# Altium project 8051ExpBoard.PrjPcb
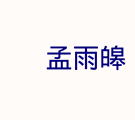
[diagram p0: 51ExpBoardTotal.SchDoc]
4 sheets, 206 parts. Net scope: flat (ports and power ports of the same name join across sheets).
Sheets:
  51ExpBoardTotal.SchDoc
  ADC_DAC.SchDoc
  CPU.SchDoc
  KeyLED.SchDoc

## Sheet 51ExpBoardTotal.SchDoc
size A4

### Notes on the sheet
- 孟雨皞

## Sheet ADC_DAC.SchDoc
size A3
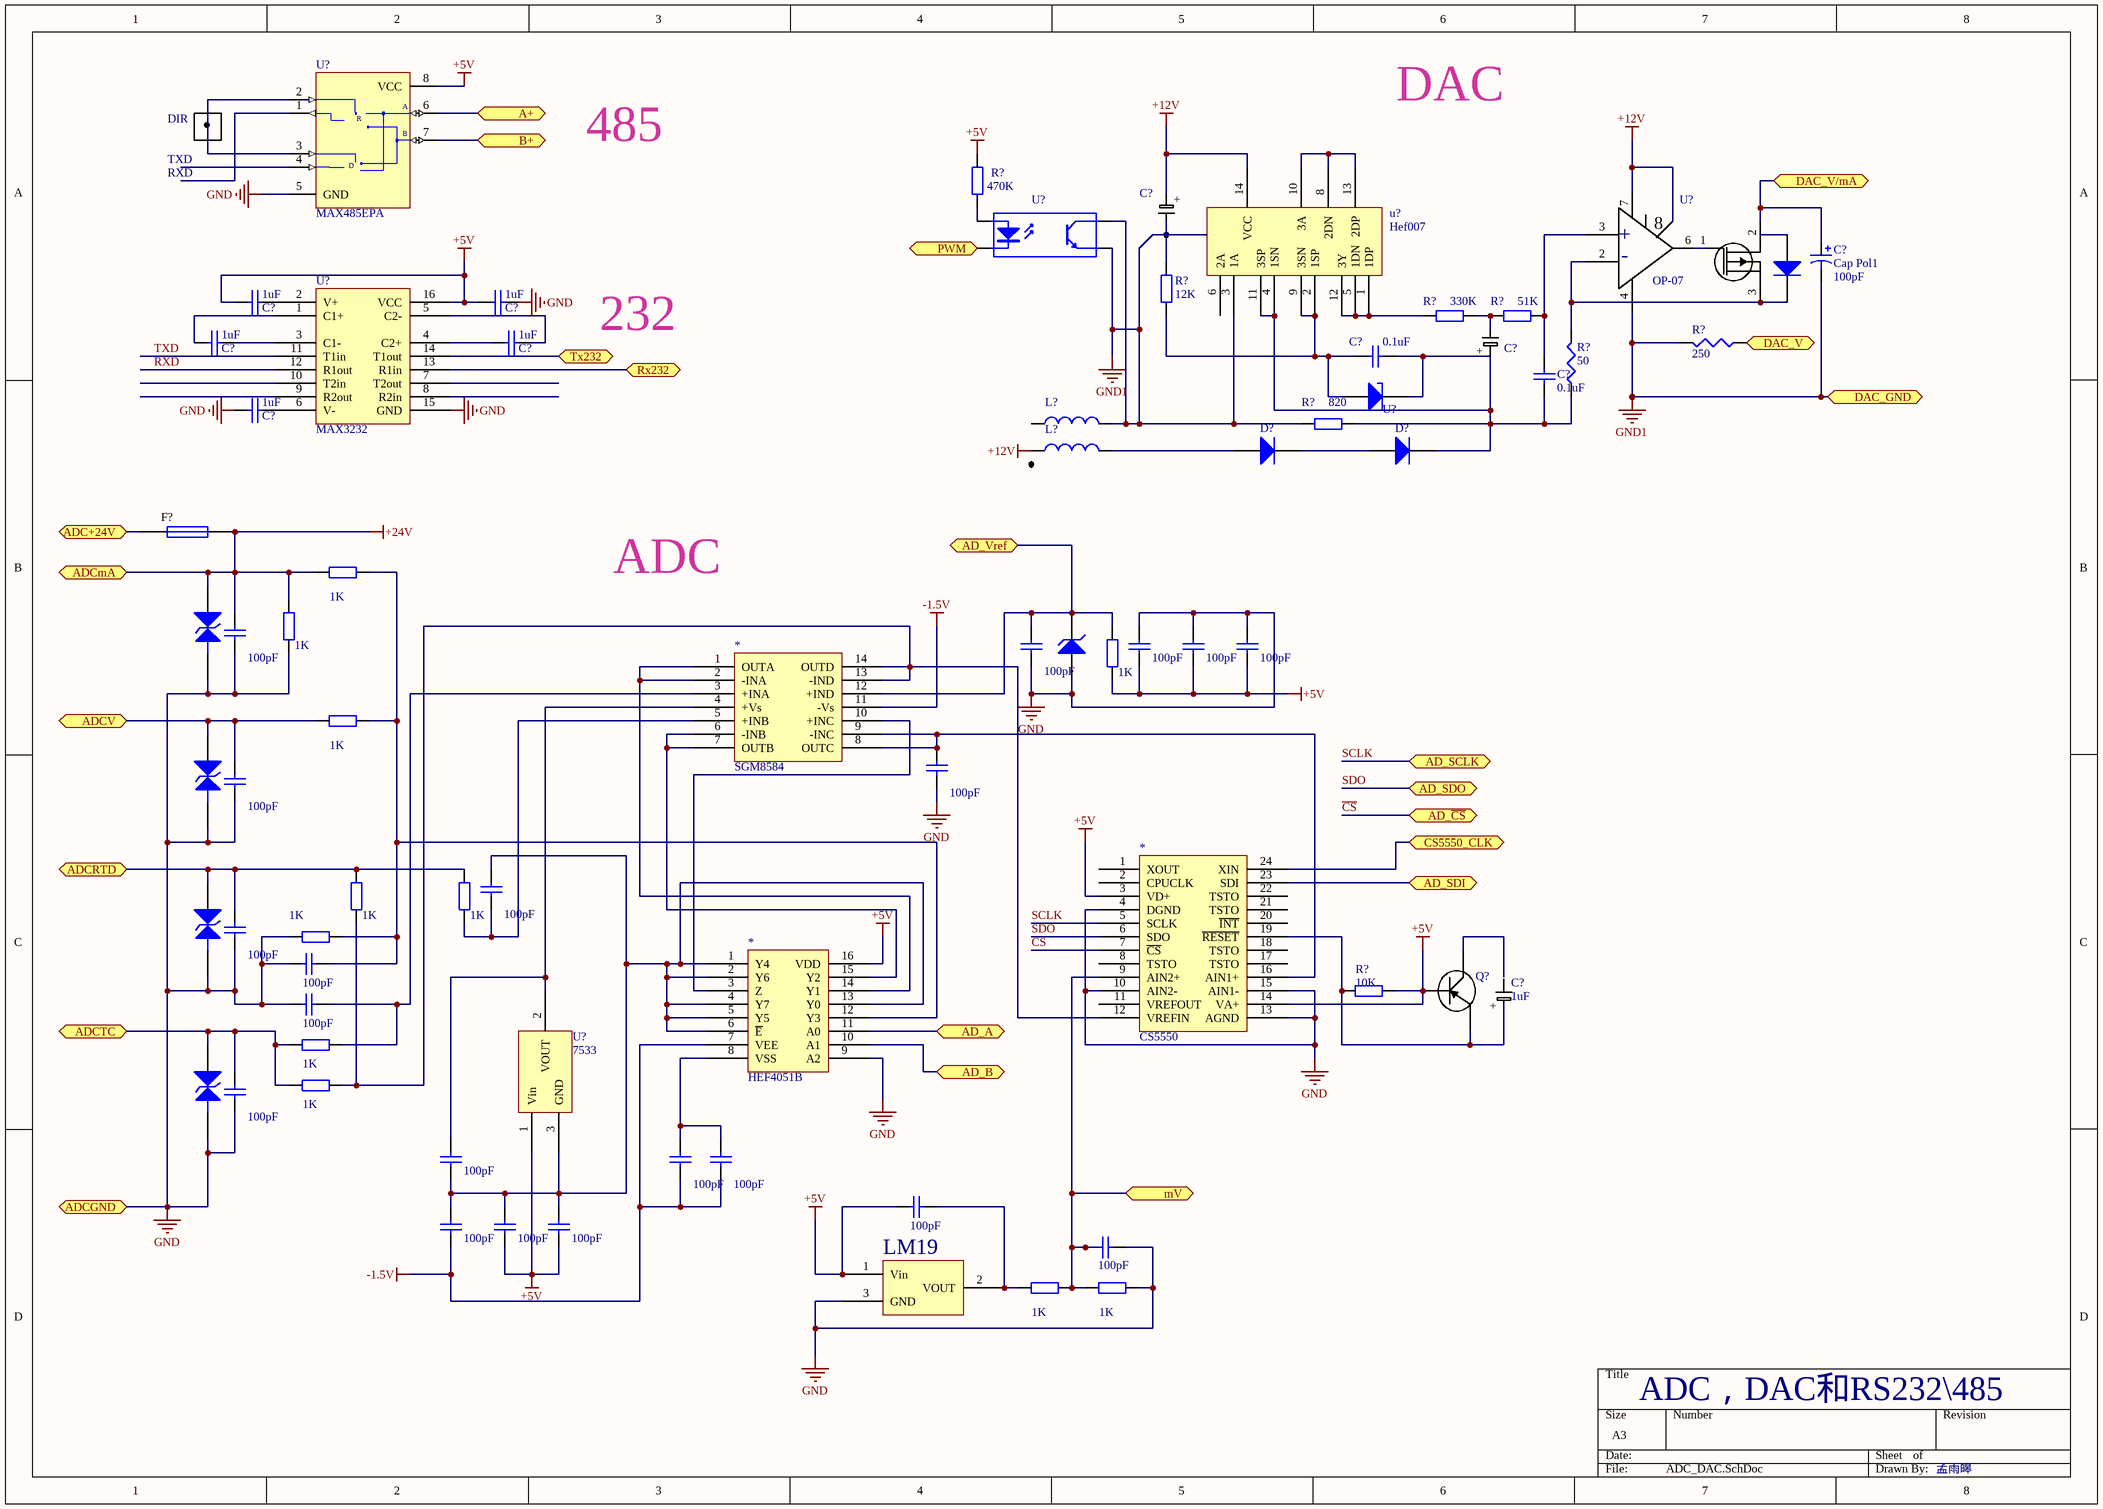
[diagram p1: ADC_DAC.SchDoc]

### Parts
(Parts that share a designator on the sheet are numbered #1, #2 ... from top to bottom, then left to right.)
*#1  ZENER3  (value not drawn)
*#2  SGM8584
*#3  CS5550
*#4  HEF4051B
*?#1  Component_1  (value not drawn)
*?#2  Component_1  (value not drawn)
*?#3  ZENER3  (value not drawn)
*?#4  ZENER3  (value not drawn)
*?#5  ZENER3  (value not drawn)
?#1  DIR
?#2  Component_1  (value not drawn)
?#3  Diode 1N4007  [D#1]  (value not drawn)
C?#1  Component_1  (value not drawn)
C?#2  Cap Pol1  value 100pF  [RB7.6-15]
C?#3  1uF  [0603C]
C?#4  1uF  [0603C]
C?#5  Component_1  (value not drawn)
C?#6  value 0.1uF  [RAD-0.3]  (hidden comment: Cap)
C?#7  1uF  [0603C]
C?#8  1uF  [0603C]
C?#9  value 0.1uF  [RAD-0.3]  (hidden comment: Cap)
C?#10  1uF  [0603C]
C?#11  value 100pF  [RAD-0.3]  (hidden comment: Cap)
C?#12  value 100pF  [RAD-0.3]  (hidden comment: Cap)
C?#13  value 100pF  [RAD-0.3]  (hidden comment: Cap)
C?#14  value 100pF  [RAD-0.3]  (hidden comment: Cap)
C?#15  value 100pF  [RAD-0.3]  (hidden comment: Cap)
C?#16  value 100pF  [RAD-0.3]  (hidden comment: Cap)
C?#17  value 100pF  [RAD-0.3]  (hidden comment: Cap)
C?#18  value 100pF  [RAD-0.3]  (hidden comment: Cap)
C?#19  value 100pF  [RAD-0.3]  (hidden comment: Cap)
C?#20  value 100pF  [RAD-0.3]  (hidden comment: Cap)
C?#21  1uF
C?#22  value 100pF  [RAD-0.3]  (hidden comment: Cap)
C?#23  value 100pF  [RAD-0.3]  (hidden comment: Cap)
C?#24  value 100pF  [RAD-0.3]  (hidden comment: Cap)
C?#25  value 100pF  [RAD-0.3]  (hidden comment: Cap)
C?#26  value 100pF  [RAD-0.3]  (hidden comment: Cap)
C?#27  value 100pF  [RAD-0.3]  (hidden comment: Cap)
C?#28  value 100pF  [RAD-0.3]  (hidden comment: Cap)
C?#29  value 100pF  [RAD-0.3]  (hidden comment: Cap)
C?#30  value 100pF  [RAD-0.3]  (hidden comment: Cap)
C?#31  value 100pF  [RAD-0.3]  (hidden comment: Cap)
D?#1  Diode 1N4007  [D#1]  (value not drawn)
D?#2  Diode 1N4007  [D#1]  (value not drawn)
D?#3  D Zener  [DIODE-0.7]  (value not drawn)
F?  12  [PIN-W2/E2.8]  (value not drawn)
L?#1  IHLP2525CZER6R8M01/6.8UH  [IHLP2525CZER6R8M01/6.8UH]  (value not drawn)
L?#2  IHLP2525CZER6R8M01/6.8UH  [IHLP2525CZER6R8M01/6.8UH]  (value not drawn)
Q#?  IRF3205  [irf3205]  (value not drawn)
Q?#1  8550  (value not drawn)
Q?#2  LM19
R?#1  value 470K  [AXIAL-0.4]  (hidden comment: Res2)
R?#2  value 12K  [AXIAL-0.4]  (hidden comment: Res2)
R?#3  value 330K  [AXIAL-0.4]  (hidden comment: Res2)
R?#4  value 51K  [AXIAL-0.4]  (hidden comment: Res2)
R?#5  value 250  [J1-0603]  (hidden comment: Res3)
R?#6  value 50  [J1-0603]  (hidden comment: Res3)
R?#7  value 820  [AXIAL-0.4]  (hidden comment: Res2)
R?#8  value 1K  [AXIAL-0.4]  (hidden comment: Res2)
R?#9  value 1K  [AXIAL-0.4]  (hidden comment: Res2)
R?#10  value 1K  [AXIAL-0.4]  (hidden comment: Res2)
R?#11  value 1K  [AXIAL-0.4]  (hidden comment: Res2)
R?#12  value 1K  [AXIAL-0.4]  (hidden comment: Res2)
R?#13  value 1K  [AXIAL-0.4]  (hidden comment: Res2)
R?#14  value 1K  [AXIAL-0.4]  (hidden comment: Res2)
R?#15  value 10K  [AXIAL-0.4]  (hidden comment: Res2)
R?#16  value 1K  [AXIAL-0.4]  (hidden comment: Res2)
R?#17  value 1K  [AXIAL-0.4]  (hidden comment: Res2)
R?#18  value 1K  [AXIAL-0.4]  (hidden comment: Res2)
R?#19  value 1K  [AXIAL-0.4]  (hidden comment: Res2)
U?#1  MAX485EPA  [PA8]
U?#2  Optoisolator1  [DIP-4]  (value not drawn)
U?#3  OP-07
u?#4  Hef007
U?#5  MAX3232  [max3232]
U?#6  SBR3U40P1  [SBR3U40P1]  (value not drawn)
U?#7  7533

### Ports
A+, AD_A, AD_B, AD_SCLK, AD_SDI, AD_SDO, AD_Vref, AD_~{CS}, ADC+24V, ADCGND, ADCmA, ADCRTD, ADCTC, ADCV, B+, CS5550_CLK, DAC_GND, DAC_V, DAC_V/mA, mV, PWM, Rx232, Tx232

### Nets
+5V: *#3.3(VD+) *#3.14(VA+) *#4.16(VDD) C?#3.1 C?#4.1 C?#13.1 C?#14.1 C?#15.1 C?#27.1 C?#29.1 C?#30.1 Q?#1.7 Q?#2.1(Vin) R?#1.2 R?#10.1 R?#15.2 U?#1.8(VCC) U?#5.16(VCC) U?#7.1(Vin)  [project net D7]
+12V: L?#2.1 U?#3.7 u?#4.14(VCC)
+24V: *#1.2(K) C?#11.2 F?.2 R?#8.1 R?#9.2 ; port ADCmA
-1.5V: *#2.11(-Vs) *#4.7(VEE) C?#25.1 C?#26.1 C?#28.1
GND: *#1.1(A) *#3.4(DGND) *#3.10(AIN2-) *#3.13(AGND) *#3.15(AIN1-) *#4.9(A2) *?#3.1(A) *?#4.1(A) *?#5.1(A) C?#4.2 C?#10.1 C?#11.1 C?#12.1 C?#13.2 C?#14.2 C?#15.2 C?#16.1 C?#17.1 C?#19.1 C?#20.1 C?#22.1 C?#23.1 C?#31.1 D?#3.1(A) Q?#2.3(GND) R?#9.1 R?#14.1 R?#19.2 U?#1.5(GND) U?#5.15(GND) ; port ADCGND
GND1: C?#2.2 L?#1.2 R?#5.2 R?#7.1 U?#2.3(E) U?#2.4(C) U?#3.4 u?#4.3(1A) ; port DAC_GND
~{CS}: *#3.7(~{CS}) ; port AD_~{CS}
RXD: U?#5.12(R1out)
SCLK: *#3.5(SCLK) ; port AD_SCLK
SDO: *#3.6(SDO) ; port AD_SDO
TXD: U?#5.11(T1in)
Net*#2_1: *#2.1(OUTA) *#2.2(-INA) *#4.14(Y1)
Net*#2_3: *#2.3(+INA) C?#22.2 R?#16.2
Net*#2_4: *#2.4(+Vs) C?#24.2 U?#7.2(VOUT)
Net*#2_5: *#2.5(+INB) C?#18.1 R?#13.1
Net*#2_6: *#2.6(-INB) *#2.7(OUTB) *#4.15(Y2)
Net*#2_8: *#2.8(OUTC) *#2.9(-INC) *#3.16(AIN1+) C?#16.2
Net*#2_10: *#2.10(+INC) *#4.3(Z)
Net*#2_12: *#2.12(+IND) C?#12.2 D?#3.2(K) R?#10.2 ; port AD_Vref
Net*#2_13: *#2.13(-IND) *#2.14(OUTD) *#3.12(VREFIN) R?#12.2 R?#17.2
Net*#3_9: *#3.9(AIN2+) C?#31.2 R?#18.2 R?#19.1 ; port mV
Net*#3_19: *#3.19(~{RESET}) Q?#1.8 R?#15.1
Net*#3_23: *#3.23(SDI) ; port AD_SDI
Net*#3_24: *#3.24(XIN) ; port CS5550_CLK
Net*#4_1: *#4.1(Y4) *#4.2(Y6) *#4.4(Y7) *#4.5(Y5) *#4.6(~{E}) *#4.13(Y0) C?#18.2 C?#24.1 C?#28.2 C?#29.2 C?#30.2 U?#7.3(GND)
Net*#4_8: *#4.8(VSS) C?#25.2 C?#26.2
Net*#4_10: *#4.10(A1) ; port AD_B
Net*#4_11: *#4.11(A0) ; port AD_A
Net*#4_12: *#4.12(Y3) C?#20.2 R?#8.2 R?#11.2 R?#14.2
Net*?#3_2: *?#3.2(K) C?#17.2 R?#11.1 ; port ADCV
Net*?#4_2: *?#4.2(K) C?#19.2 R?#12.1 R?#13.2 ; port ADCRTD
Net*?#5_2: *?#5.2(K) C?#23.2 R?#16.1 R?#17.1 ; port ADCTC
Net?#3_2: ?#3.2(K) Q#?.3(S) R?#6.2 U?#3.2
NetC?#2_1: C?#2.1 Q#?.2(D) ; port DAC_V/mA
NetC?#3_2: C?#3.2 U?#5.2(V+)
NetC?#6_1: C?#6.1 R?#2.1 u?#4.2(1SP) u?#4.9(3SN) U?#6.1(A)
NetC?#6_2: C?#6.2 C?#9.1 D?#2.2(K) R?#6.1 R?#7.2 u?#4.4(1SN) u?#4.11(3SP) U?#6.2(K)
NetC?#7_1: C?#7.1 U?#5.1(C1+)
NetC?#7_2: C?#7.2 U?#5.3(C1-)
NetC?#8_1: C?#8.1 U?#5.4(C2+)
NetC?#8_2: C?#8.2 U?#5.5(C2-)
NetC?#9_2: C?#9.2 R?#4.2 U?#3.3
NetC?#10_2: C?#10.2 U?#5.6(V-)
NetC?#27_2: C?#27.2 Q?#2.2(VOUT) R?#18.1
NetD?#1_1: D?#1.1(A) L?#2.2
NetD?#1_2: D?#1.2(K) D?#2.1(A)
NetF?_1: F?.1 ; port ADC+24V
NetQ#?_1: Q#?.1 U?#3.6
NetR?#1_1: R?#1.1 U?#2.1(A)
NetR?#3_1: R?#3.1 u?#4.1(1DP) u?#4.5(1DN) u?#4.12(3Y)
NetR?#3_2: R?#3.2 R?#4.1
NetR?#5_1: R?#5.1 ; port DAC_V
NetU?#1_2: U?#1.2(~{RE}) U?#1.3(DE)
NetU?#1_6: U?#1.6(A) ; port A+
NetU?#1_7: U?#1.7(B) ; port B+
NetU?#2_2: U?#2.2(K) ; port PWM
Netu?#4_8: u?#4.8(2DN) u?#4.10(3A) u?#4.13(2DP)
NetU?#5_13: U?#5.13(R1in) ; port Rx232
NetU?#5_14: U?#5.14(T1out) ; port Tx232

Not connected (* = marked no-connect by the designer): *#3 1(XOUT) 2(CPUCLK) 8(TSTO) 11(VREFOUT) 17(TSTO) 18(TSTO) 20(~{INT}) 21(TSTO) 22(TSTO); ?#3 1(A); L?#1 1; Q?#1 9; R?#2 2; U?#1 1(RO) 4(DI); U?#3 17; u?#4 6(2A); U?#5 7(T2out) 8(R2in) 9(R2out) 10(T2in)

### Notes on the sheet
- DAC
- (near ?#1) TXD
- RXD
- 485
- 232
- ADC
- ADC，DAC和RS232\485
- 孟雨皞
- (in symbol Component_1) +
- (in symbol MAX485EPA) R; D
- (in symbol 方框) .
- (in symbol 运放) 8; +; -

### Library data of the parts
?#1 = 方框
?#3 D?#1 D?#2 = Diode 1N4007: 1 Amp General Purpose Rectifier; Published: 8-Jun-2000; LatestRevisionDate: 17-Jul-2002; LatestRevisionNote: Re-released for DXP Platform.; DatasheetDocument: 1998; PackageDocument: Aug-1999; PackageReference: DO-41; Publisher: Altium Limited; Code_JEDEC: DO-204-AL; ComponentLink1Description: Manufacturer Link; ComponentLink1URL: http://www.fairchildsemi.com/; ComponentLink2Description: Datasheet; ComponentLink2URL: http://www.fairchildsemi.com/ds/1N%2F1N4001.pdf
C?#2 = Cap Pol1: Polarized Capacitor (Radial); Published: 8-Jun-2000; LatestRevisionDate: 17-Jul-2002; LatestRevisionNote: Re-released for DXP Platform.; PackageReference: RB7.6-15; Publisher: Altium Limited; PackageDescription: Polarized Capacitor (Radial); 2 Leads
C?#3 C?#4 C?#7 C?#8 C?#10 = CAP: Capacitor
C?#6 C?#9 C?#11-C?#20 C?#22-C?#31 = Cap: Capacitor; Published: 8-Jun-2000; LatestRevisionDate: 17-Jul-2002; LatestRevisionNote: Re-released for DXP Platform.; PackageReference: RAD-0.3; Publisher: Altium Limited; PackageDescription: Radial Cap, Thru-Hole; 2 Leads; 0.3 in Pin Spacing
C?#21 Q?#2 u?#4 U?#7 = Component_1
D?#3 = D Zener: Zener Diode; Published: 8-Jun-2000; LatestRevisionDate: 17-Jul-2002; LatestRevisionNote: Re-released for DXP Platform.; PackageReference: DIODE-0.7; Publisher: Altium Limited; PackageDescription: Diode, Thru-Hole; 2 Leads; 0.7 in Pin Spacing
F? = Fuse 1: Fuse; Published: 8-Jun-2000; LatestRevisionDate: 17-Jul-2002; LatestRevisionNote: Re-released for DXP Platform.; PackageReference: PIN-W2/E2.8; Publisher: Altium Limited; PackageDescription: Thru-Hole; 2 Leads
L?#1 L?#2 = Inductor: Code_IEC: 1005; Value: 4.7uh; Published: 8-Jun-2000; LatestRevisionDate: 17-Jul-2002; LatestRevisionNote: Re-released for DXP Platform.; PackageReference: 0402-A; Publisher: Altium Limited; Code_JEITA: 0402
Q#? = PMOS1: N-Channel Power MOSFET; Note: Pin 2 is electrically connected to pin 4.; Published: 8-Jun-2000; LatestRevisionDate: 17-Jul-2002; LatestRevisionNote: Re-released for DXP Platform.; DatasheetVersion: PD-9.814; PackageReference: TO-220AB; Publisher: Altium Limited; Code_JEDEC: TO-220-AB; ComponentLink1Description: Manufacturer Link; ComponentLink1URL: http://www.irf.com/
R?#1-R?#4 R?#7-R?#19 = Res2: Resistor; Published: 8-Jun-2000; LatestRevisionDate: 17-Jul-2002; LatestRevisionNote: Re-released for DXP Platform.; PackageReference: AXIAL-0.4; Publisher: Altium Limited
  R?#8-R?#14 R?#16-R?#19: PackageDescription: Axial Device, Thru-Hole; 2 Leads; 0.4 in Pin Spacing
R?#5 R?#6 = Res3: Resistor; Published: 8-Jun-2000; LatestRevisionDate: 04-Mar-2005; LatestRevisionNote: PCB Footprint replaced.; PackageReference: J1-0603; Publisher: Altium Limited
U?#1 = MAX485EPA: Low-Power, Slew-Rate-Limited RS-485/RS-422 Transceiver; Published: 16-Jan-2001; LatestRevisionDate: 29-May-2009; LatestRevisionNote: Component Body Added.; DatasheetVersion: Feb-1996; PackageVersion: RevB, 21-0043; PackageReference: PA8; Publisher: Altium Limited; PackageDescription: DIP, 8-Pin, Row Spacing 7.62 mm, Pitch 2.54 mm; Code_JEDEC: MS-001-AB; ComponentLink1Description: Manufacturer Link; ComponentLink1URL: http://www.maxim-ic.com/; ComponentLink2Description: Datasheet; ComponentLink2URL: http://pdfserv.maxim-ic.com/en/ds/MAX1487-MAX491.pdf
U?#2 = Optoisolator1: 4-Pin Phototransistor Optocoupler; Published: 24-Mar-1999; LatestRevisionDate: 04-Mar-2005; LatestRevisionNote: Sch pins 3 & 4 Swapped.; DatasheetVersion: Nov-2003; PackageReference: DIP-4; Publisher: Altium Limited
U?#3 = 运放
U?#6 = 稳压管: Zener Diode; Published: 8-Jun-2000; LatestRevisionDate: 17-Jul-2002; LatestRevisionNote: Re-released for DXP Platform.; PackageReference: DIODE-0.7; Publisher: Altium Limited

## Sheet CPU.SchDoc
size A3
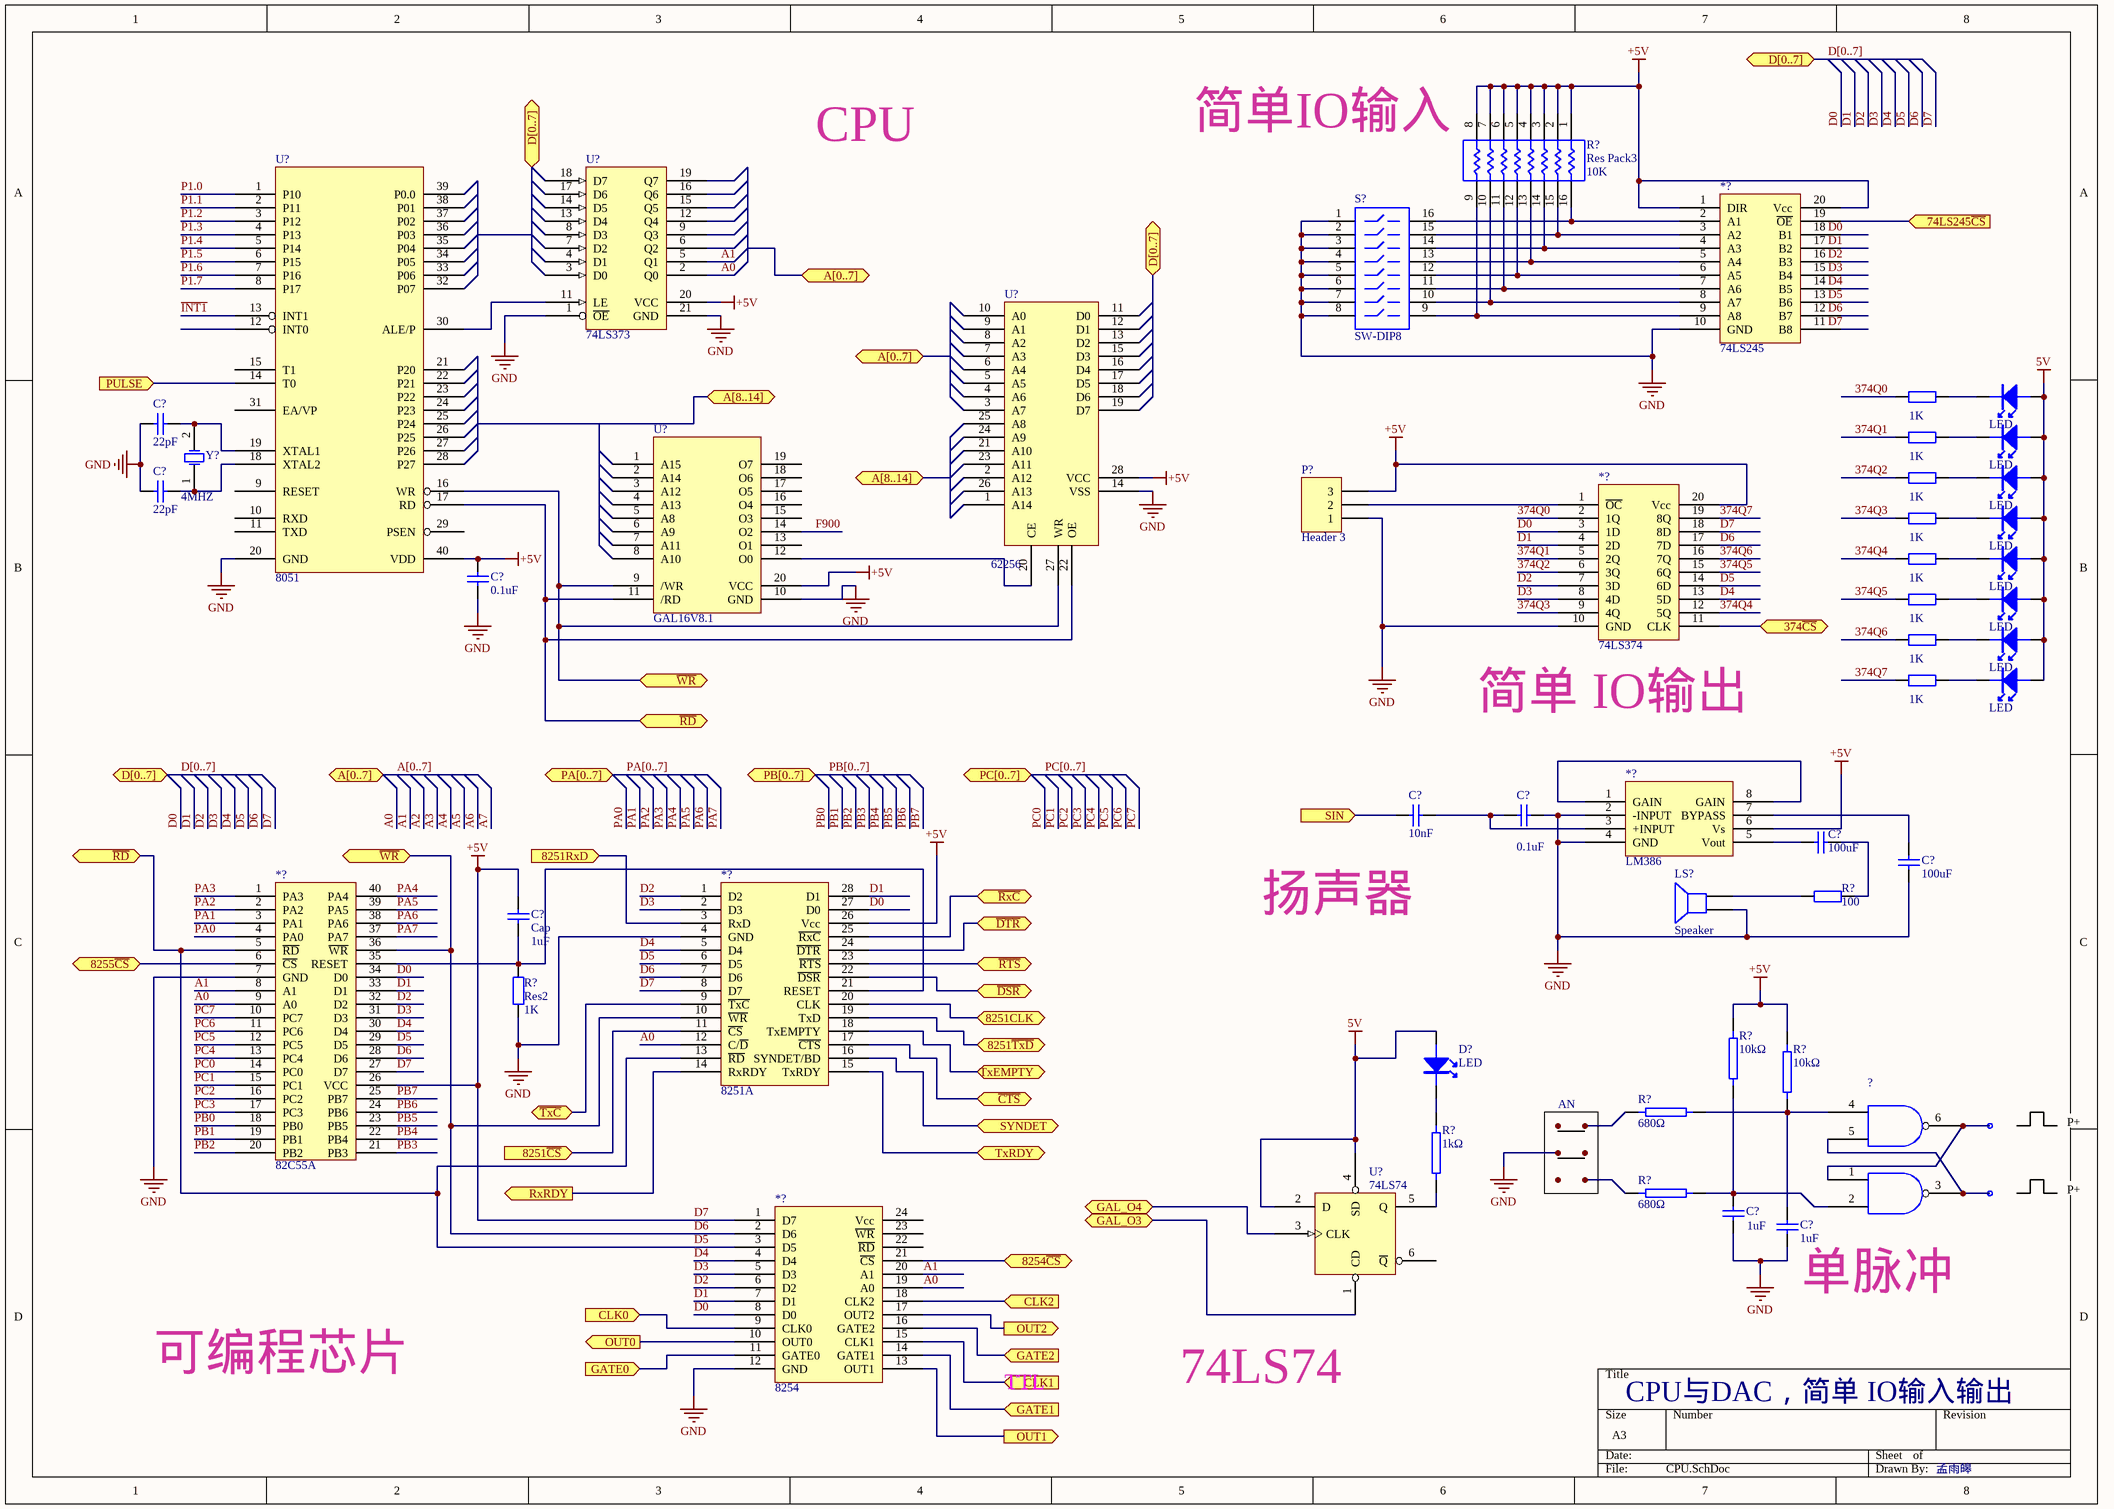
[diagram p2: CPU.SchDoc]

### Parts
(Parts that share a designator on the sheet are numbered #1, #2 ... from top to bottom, then left to right.)
*?#6  74LS245
*?#7  74LS374
*?#8  LM386
*?#9  8251A
*?#10  82C55A
*?#11  8254
?#4  74LS00  (value not drawn)
C?#32  value 22pF  [RAD-0.3]
C?#33  value 22pF  [RAD-0.3]
C?#34  value 0.1uF  [RAD-0.3]
C?#35  value 0.1uF  [RAD-0.3]
C?#36  value 10nF  [RAD-0.3]
C?#37  value 100uF  [RAD-0.3]
C?#38  value 100uF  [RAD-0.3]
C?#39  Cap  value 1uF  [RAD-0.3]
C?#40  value 1uF  [RAD-0.3]
C?#41  value 1uF  [RAD-0.3]
D?#4  LED
D?#5  LED
D?#6  LED
D?#7  LED
D?#8  LED
D?#9  LED
D?#10  LED
D?#11  LED
D?#12  LED
LS?  Speaker  [PIN2]
P?  Header 3  [HDR1X3]
R?#20  Res Pack3  value 10K  [SO-16_N]
R?#21  value 1K  [AXIAL-0.4]  (hidden comment: Res2)
R?#22  value 1K  [AXIAL-0.4]  (hidden comment: Res2)
R?#23  value 1K  [AXIAL-0.4]  (hidden comment: Res2)
R?#24  value 1K  [AXIAL-0.4]  (hidden comment: Res2)
R?#25  value 1K  [AXIAL-0.4]  (hidden comment: Res2)
R?#26  value 1K  [AXIAL-0.4]  (hidden comment: Res2)
R?#27  value 1K  [AXIAL-0.4]  (hidden comment: Res2)
R?#28  value 1K  [AXIAL-0.4]  (hidden comment: Res2)
R?#29  value 100  [AXIAL-0.4]
R?#30  Res2  value 1K  [AXIAL-0.4]
R?#31  10kΩ
R?#32  10kΩ
R?#33  680Ω
R?#34  1kΩ
R?#35  680Ω
S?#1  SW-DIP8  [DIP-16-KEY]
U?#8  74LS373
U?#9  62256
U?#10  8051
U?#11  GAL16V8.1
U?#12  74LS74
Y?  4MHZ  [crystals]

### Ports
74LS245~{CS} (in), 374~{CS}, 8251CLK, 8251RxD (in), 8251~{CS} (in), 8251~{TxD}, 8254~{CS}, 8255~{CS}, A[0..7], A[0..7] (bidir), A[8..14], CLK0 (in), CLK1 (in), CLK2 (in), D[0..7], D[0..7] (bidir), GAL_O3, GAL_O4, GATE0 (in), GATE1 (in), GATE2 (in), OUT0 (out), OUT1 (out), OUT2 (out), PA[0..7] (bidir), PB[0..7] (bidir), PC[0..7] (bidir), PULSE (in), RxRDY (out), SIN (in), SYNDET, TxEMPTY (bidir), TxRDY, ~{CTS}, ~{DSR}, ~{DTR} (bidir), ~{RD}, ~{RD} (bidir), ~{RTS} (bidir), ~{RxC}, ~{TxC}, ~{WR}

### Nets
5V: D?#4.1 D?#5.1 D?#6.1 D?#7.1 D?#8.1 D?#9.1 D?#10.1 D?#11.1 D?#12.1 U?#12.2(D) U?#12.4(SD)
D7: *?#6.1(DIR) *?#6.20(Vcc) *?#7.18(8D) *?#7.20(Vcc) *?#8.6(Vs) *?#9.8(D7) *?#9.26(Vcc) *?#10.26(VCC) *?#10.27(D7) *?#11.1(D7) C?#34.1 C?#39.1 P?.3 R?#20.1 R?#20.2 R?#20.3 R?#20.4 R?#20.5 R?#20.6 R?#20.7 R?#20.8 R?#31.2 R?#32.2 U?#8.20(VCC) U?#9.28(VCC) U?#10.40(VDD) U?#11.20(VCC)  [also labelled +5V]
GND: *?#6.10(GND) *?#7.10(GND) *?#8.2(-INPUT) *?#8.4(GND) *?#9.4(GND) *?#10.7(GND) *?#11.12(GND) C?#32.2 C?#33.2 C?#34.2 C?#35.2 C?#38.1 C?#40.1 C?#41.1 LS?.1 P?.1 R?#30.2 S?#1.1 S?#1.2 S?#1.3 S?#1.4 S?#1.5 S?#1.6 S?#1.7 S?#1.8 U?#8.1(~{OE}) U?#8.21(GND) U?#9.14(VSS) U?#10.20(GND) U?#11.10(GND)
374Q0: *?#7.2(1Q) R?#21.1
374Q1: *?#7.5(2Q) R?#22.1
374Q2: *?#7.6(3Q) R?#23.1
374Q3: *?#7.9(4Q) R?#24.1
374Q4: *?#7.12(5Q) R?#25.1
374Q5: *?#7.15(6Q) R?#26.1
374Q6: *?#7.16(7Q) R?#27.1
374Q7: *?#7.19(8Q) R?#28.1
A0: *?#9.12(C/~{D}) *?#10.9(A0) *?#11.19(A0) U?#8.2(Q0)
A1: *?#10.8(A1) *?#11.20(A1) U?#8.5(Q1)
D0: *?#7.3(1D) *?#9.27(D0) *?#10.34(D0) *?#11.8(D0)
D1: *?#7.4(2D) *?#9.28(D1) *?#10.33(D1) *?#11.7(D1)
D2: *?#7.7(3D) *?#9.1(D2) *?#10.32(D2) *?#11.6(D2)
D3: *?#7.8(4D) *?#9.2(D3) *?#10.31(D3) *?#11.5(D3)
D4: *?#7.13(5D) *?#9.5(D4) *?#10.30(D4) *?#11.4(D4)
D5: *?#7.14(6D) *?#9.6(D5) *?#9.13(~{RD}) *?#10.5(~{RD}) *?#10.29(D5) *?#11.3(D5) U?#9.22(OE) U?#10.17(RD) U?#11.11(/RD) ; port ~{RD}
D6: *?#7.17(7D) *?#9.7(D6) *?#9.10(~{WR}) *?#10.28(D6) *?#10.36(~{WR}) *?#11.2(D6) U?#9.27(WR) U?#10.16(WR) U?#11.9(/WR) ; port ~{WR}
F900: U?#11.14(O2)
~{INT1}: U?#10.13(INT1)
P1.0: U?#10.1(P10)
P1.1: U?#10.2(P11)
P1.2: U?#10.3(P12)
P1.3: U?#10.4(P13)
P1.4: U?#10.5(P14)
P1.5: U?#10.6(P15)
P1.6: U?#10.7(P16)
P1.7: U?#10.8(P17)
PA0: *?#10.4(PA0)
PA1: *?#10.3(PA1)
PA2: *?#10.2(PA2)
PA3: *?#10.1(PA3)
PA4: *?#10.40(PA4)
PA5: *?#10.39(PA5)
PA6: *?#10.38(PA6)
PA7: *?#10.37(PA7)
PB0: *?#10.18(PB0)
PB1: *?#10.19(PB1)
PB2: *?#10.20(PB2)
PB3: *?#10.21(PB3)
PB4: *?#10.22(PB4)
PB5: *?#10.23(PB5)
PB6: *?#10.24(PB6)
PB7: *?#10.25(PB7)
PC0: *?#10.14(PC0)
PC1: *?#10.15(PC1)
PC2: *?#10.16(PC2)
PC3: *?#10.17(PC3)
PC4: *?#10.13(PC4)
PC5: *?#10.12(PC5)
PC6: *?#10.11(PC6)
PC7: *?#10.10(PC7)
Net*?#6_2: *?#6.2(A1) R?#20.16 S?#1.16
Net*?#6_3: *?#6.3(A2) R?#20.15 S?#1.15
Net*?#6_4: *?#6.4(A3) R?#20.14 S?#1.14
Net*?#6_5: *?#6.5(A4) R?#20.13 S?#1.13
Net*?#6_6: *?#6.6(A5) R?#20.12 S?#1.12
Net*?#6_7: *?#6.7(A6) R?#20.11 S?#1.11
Net*?#6_8: *?#6.8(A7) R?#20.10 S?#1.10
Net*?#6_9: *?#6.9(A8) R?#20.9 S?#1.9
Net*?#6_19: *?#6.19(~{OE}) ; port 74LS245~{CS}
Net*?#7_1: *?#7.1(~{OC}) P?.2
Net*?#7_11: *?#7.11(CLK) ; port 374~{CS}
Net*?#8_1: *?#8.1(GAIN) *?#8.8(GAIN)
Net*?#8_3: *?#8.3(+INPUT) C?#35.1 C?#36.1
Net*?#8_5: *?#8.5(Vout) C?#37.1
Net*?#8_7: *?#8.7(BYPASS) C?#38.2
Net*?#9_3: *?#9.3(RxD) ; port 8251RxD
Net*?#9_9: *?#9.9(~{TxC}) ; port ~{TxC}
Net*?#9_11: *?#9.11(~{CS}) ; port 8251~{CS}
Net*?#9_14: *?#9.14(RxRDY) ; port RxRDY
Net*?#9_15: *?#9.15(TxRDY) ; port TxRDY
Net*?#9_16: *?#9.16(SYNDET/BD) ; port SYNDET
Net*?#9_17: *?#9.17(~{CTS}) ; port ~{CTS}
Net*?#9_18: *?#9.18(TxEMPTY) ; port TxEMPTY
Net*?#9_19: *?#9.19(TxD) ; port 8251~{TxD}
Net*?#9_20: *?#9.20(CLK) ; port 8251CLK
Net*?#9_21: *?#9.21(RESET) *?#10.35(RESET) C?#39.2 R?#30.1
Net*?#9_22: *?#9.22(~{DSR}) ; port ~{DSR}
Net*?#9_23: *?#9.23(~{RTS}) ; port ~{RTS}
Net*?#9_24: *?#9.24(~{DTR}) ; port ~{DTR}
Net*?#9_25: *?#9.25(~{RxC}) ; port ~{RxC}
Net*?#10_6: *?#10.6(~{CS}) ; port 8255~{CS}
Net*?#11_9: *?#11.9(CLK0) ; port CLK0
Net*?#11_10: *?#11.10(OUT0) ; port OUT0
Net*?#11_11: *?#11.11(GATE0) ; port GATE0
Net*?#11_13: *?#11.13(OUT1) ; port OUT1
Net*?#11_14: *?#11.14(GATE1) ; port GATE1
Net*?#11_15: *?#11.15(CLK1) ; port CLK1
Net*?#11_16: *?#11.16(GATE2) ; port GATE2
Net*?#11_17: *?#11.17(OUT2) ; port OUT2
Net*?#11_18: *?#11.18(CLK2) ; port CLK2
Net*?#11_21: *?#11.21(~{CS}) ; port 8254~{CS}
Net*?#12_10: U?#10.14(T0) ; port PULSE
Net?#4_1: ?#4.1 ?#4.6
Net?#4_2: ?#4.2 C?#40.2 R?#31.1 R?#35.2
Net?#4_3: ?#4.3 ?#4.5
Net?#4_4: ?#4.4 C?#41.2 R?#32.1 R?#33.2
NetC?#32_1: C?#32.1 U?#10.19(XTAL1) Y?.2(OSC2)
NetC?#33_1: C?#33.1 U?#10.18(XTAL2) Y?.1(OSC1)
NetC?#36_2: C?#36.2 ; port SIN
NetC?#37_2: C?#37.2 R?#29.2
NetD?#4_2: D?#4.2 R?#21.2
NetD?#5_2: D?#5.2 R?#22.2
NetD?#6_2: D?#6.2 R?#23.2
NetD?#7_2: D?#7.2 R?#24.2
NetD?#8_2: D?#8.2 R?#25.2
NetD?#9_2: D?#9.2 R?#26.2
NetD?#10_2: D?#10.2 R?#27.2
NetD?#11_2: D?#11.2 R?#28.2
NetD?#12_2: D?#12.2 R?#34.2
NetLS?_2: LS?.2 R?#29.1
NetR?#34_1: R?#34.1 U?#12.5(Q)
NetU?#8_11: U?#8.11(LE) U?#10.30(ALE/P)
NetU?#9_20: U?#9.20(CE) U?#11.12(O0)
NetU?#12_1: U?#12.1(CD) ; port GAL_O3
NetU?#12_3: U?#12.3(CLK) ; port GAL_O4

Not connected (* = marked no-connect by the designer): *?#6 11(B8) 12(B7) 13(B6) 14(B5) 15(B4) 16(B3) 17(B2) 18(B1); *?#11 22(~{RD}) 23(~{WR}) 24(Vcc); R?#33 1; R?#35 1; U?#8 3(D0) 4(D1) 6(Q2) 7(D2) 8(D3) 9(Q3) 12(Q4) 13(D4) 14(D5) 15(Q5) 16(Q6) 17(D6) 18(D7) 19(Q7); U?#9 1(A14) 2(A12) 3(A7) 4(A6) 5(A5) 6(A4) 7(A3) 8(A2) 9(A1) 10(A0) 11(D0) 12(D1) 13(D2) 15(D3) 16(D4) 17(D5) 18(D6) 19(D7) 21(A10) 23(A11) 24(A9) 25(A8) 26(A13); U?#10 9(RESET) 10(RXD) 11(TXD) 12(INT0) 15(T1) 21(P20) 22(P21) 23(P22) 24(P23) 25(P24) 26(P25) 27(P26) 28(P27) 29(PSEN) 31(EA/VP) 32(P07) 33(P06) 34(P05) 35(P04) 36(P03) 37(P02) 38(P01) 39(P0.0); U?#11 1(A15) 2(A14) 3(A12) 4(A13) 5(A8) 6(A9) 7(A11) 8(A10) 13(O1) 15(O3) 16(O4) 17(O5) 18(O6) 19(O7); U?#12 6(~{Q})

### Buses and harness runs
bus A[0..7] = port A[0..7]
bus D[0..7] = port D[0..7]
bus PA[0..7] = port PA[0..7]
bus PB[0..7] = port PB[0..7]
bus PC[0..7] = port PC[0..7]

### Notes on the sheet
- CPU
- 简单IO输入
- (near *?#7) 简单 IO输出
- 扬声器
- AN
- P+
- (near C?#41) 单脉冲
- 可编程芯片
- TTL
- 74LS74
- CPU与DAC，简单 IO输入输出
- 孟雨皞
- Labels drawn without touching a wire or pin: D0, D1, D2, D3, D4, D5, D6, D7

### Library data of the parts
C?#32-C?#41 = Cap: Capacitor; Published: 8-Jun-2000; LatestRevisionDate: 17-Jul-2002; LatestRevisionNote: Re-released for DXP Platform.; PackageReference: RAD-0.3; Publisher: Altium Limited
  C?#39: PackageDescription: Radial Cap, Thru-Hole; 2 Leads; 0.3 in Pin Spacing
LS? = Speaker: Loudspeaker; Published: 24-Mar-1999; LatestRevisionDate: 17-Jul-2002; LatestRevisionNote: Re-released for DXP Platform.; PackageReference: PIN2; Publisher: Altium Limited
P? = Header 3: Header, 3-Pin; LatestRevisionDate: 17-Jul-2002; LatestRevisionNote: Re-released for DXP Platform.; Publisher: Altium Limited
R?#20 = Res Pack3: Isolated Resistor Network; Published: 24-Mar-1999; LatestRevisionDate: 29-May-2009; LatestRevisionNote: IPC-7351 Footprint Added.; PackageReference: SO-16; Publisher: Altium Limited; PackageDescription: 16-Pin Small Outline Integrated Circuit 1.27 mm Pitch; Code_JEDEC: MS-012-AC; Code_IPC: SOIC127P600-16
R?#21-R?#30 = Res2: Resistor; Published: 8-Jun-2000; LatestRevisionDate: 17-Jul-2002; LatestRevisionNote: Re-released for DXP Platform.; PackageReference: AXIAL-0.4; Publisher: Altium Limited
  R?#21-R?#28 R?#30: PackageDescription: Axial Device, Thru-Hole; 2 Leads; 0.4 in Pin Spacing
R?#31-R?#35 = 电阻
S?#1 = SW-DIP8: 4009 Series DIP Switch, Raised actuator; Published: 24-Mar-1999; LatestRevisionDate: 17-Dec-2003; LatestRevisionNote: PCB Footprint replaced.; PackageReference: DIP-16-KEY; Publisher: Altium Limited; PackageDescription: DIP; 16 Leads; Row Spacing 7.62 mm; Pitch 2.54 mm; ComponentLink1Description: Manufacturer Link; ComponentLink1URL: http://www.oupiin.com/prodindx.html#Headers
Y? = XTAL: Crystal Oscillator; Published: 8-Jun-2000; LatestRevisionDate: 17-Jul-2002; LatestRevisionNote: Re-released for DXP Platform.; PackageReference: R38; Publisher: Altium Limited

## Sheet KeyLED.SchDoc
size A3
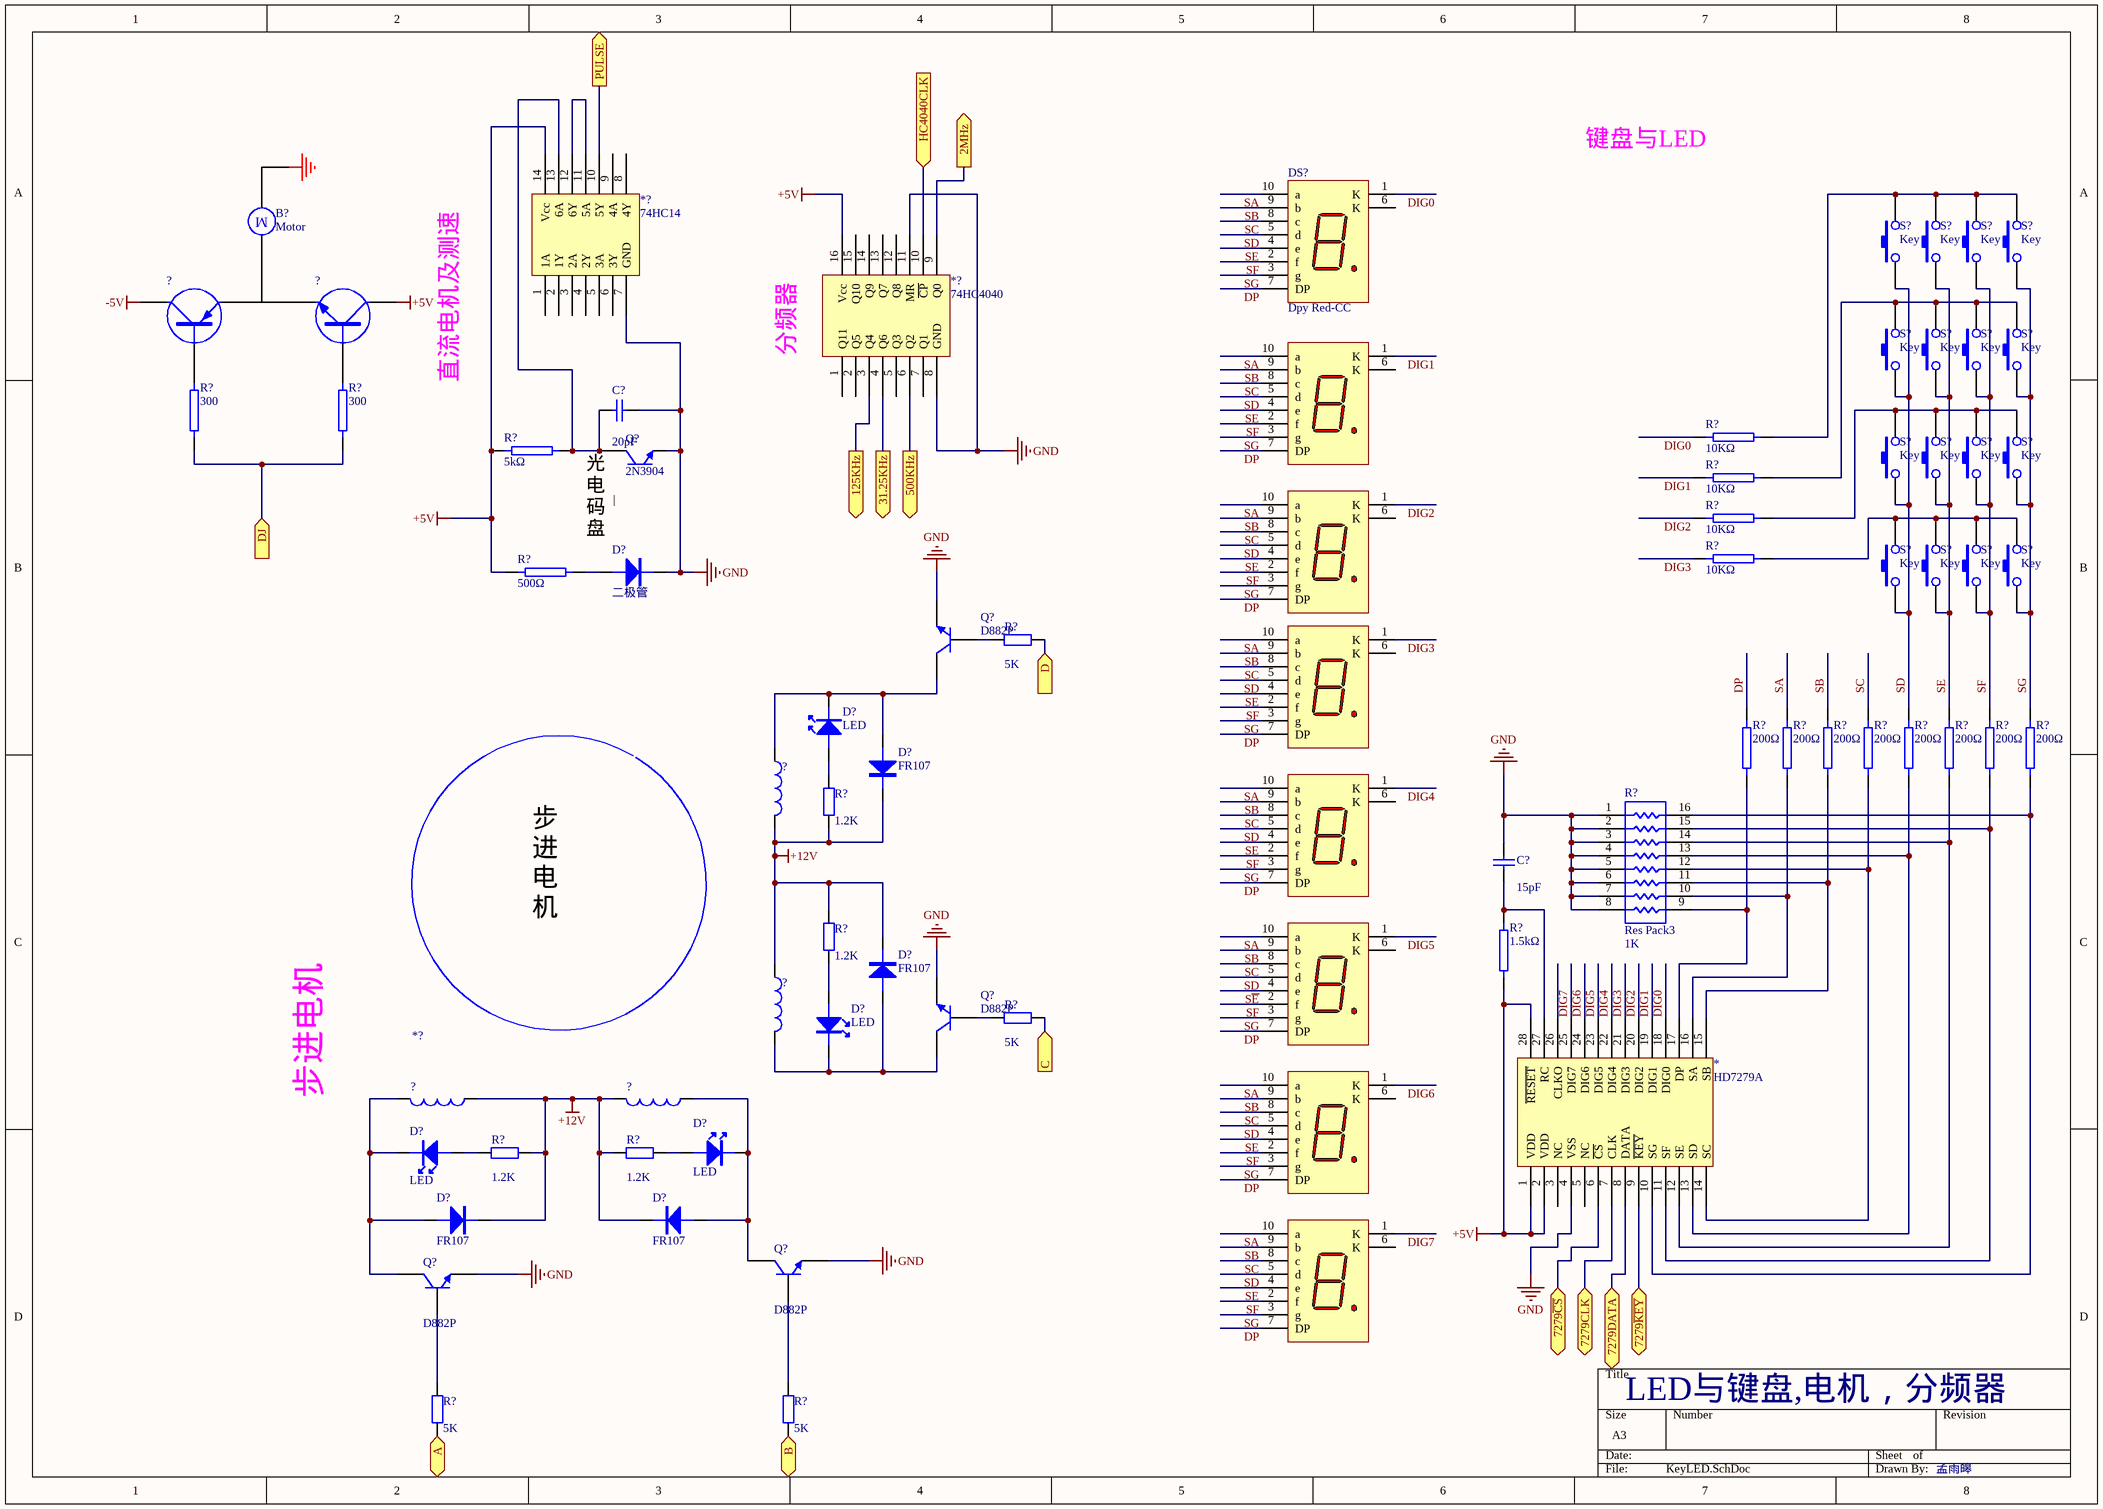
[diagram p3: KeyLED.SchDoc]

### Parts
(Parts that share a designator on the sheet are numbered #1, #2 ... from top to bottom, then left to right.)
*#5  HD7279A
*?#12  74HC14
*?#13  74HC4040
*?#14  bujindianji  (value not drawn)
?#5  (no value)
?#6  (no value)
?#7  Inductor  [INDC1005AL]  (value not drawn)
?#8  (no value)  [INDC1005AL]
?#9  Inductor  [INDC1005AL]  (value not drawn)
?#10  Inductor  [INDC1005AL]  (value not drawn)
B?  Motor  [RB5-10.5]
C?#42  value 20pF  [RAD-0.3]
C?#43  value 15pF  [RAD-0.3]
D?#13  二极管
D?#14  LED
D?#15  FR107
D?#16  FR107
D?#17  LED
D?#18  LED
D?#19  LED
D?#20  FR107
D?#21  FR107
DS?#1  Dpy Red-CC  [A]
DS?#2  Dpy Red-CC  [A]  (value not drawn)
DS?#3  Dpy Red-CC  [A]  (value not drawn)
DS?#4  Dpy Red-CC  [A]  (value not drawn)
DS?#5  Dpy Red-CC  [A]  (value not drawn)
DS?#6  Dpy Red-CC  [A]  (value not drawn)
DS?#7  Dpy Red-CC  [A]  (value not drawn)
DS?#8  Dpy Red-CC  [A]  (value not drawn)
Q?#3  2N3904  [BCY-W3/E4]
Q?#4  D882P  [sot-23]
Q?#5  D882P  [sot-23]
Q?#6  D882P  [sot-23]
Q?#7  D882P  [sot-23]
R?#36  300
R?#37  300
R?#38  10KΩ
R?#39  5kΩ
R?#40  10KΩ
R?#41  10KΩ
R?#42  10KΩ
R?#43  500Ω
R?#44  value 5K  [AXIAL-0.4]
R?#45  200Ω
R?#46  200Ω
R?#47  200Ω
R?#48  200Ω
R?#49  200Ω
R?#50  200Ω
R?#51  200Ω
R?#52  200Ω
R?#53  Res Pack3  value 1K  [SO-16_N]
R?#54  value 1.2K  [AXIAL-0.4]
R?#55  value 1.2K  [AXIAL-0.4]
R?#56  1.5kΩ
R?#57  value 5K  [AXIAL-0.4]
R?#58  value 1.2K  [AXIAL-0.4]
R?#59  value 1.2K  [AXIAL-0.4]
R?#60  value 5K  [AXIAL-0.4]
R?#61  value 5K  [AXIAL-0.4]
S?#2  Key
S?#3  Key
S?#4  Key
S?#5  Key
S?#6  Key
S?#7  Key
S?#8  Key
S?#9  Key
S?#10  Key
S?#11  Key
S?#12  Key
S?#13  Key
S?#14  Key
S?#15  Key
S?#16  Key
S?#17  Key

### Ports
2MHz (out), 31.25KHz (out), 125KHz (out), 500KHz (out), 7279CLK, 7279DATA, 7279~{CS} (bidir), 7279~{KEY}, A (in), B (in), C (in), D (in), DJ (in), HC4040CLK (in), PULSE (out)

### Nets
+5V: *#5.1(VDD) *#5.2(VDD) *#5.28(~{RESET}) *?#12.14(Vcc) *?#13.16(Vcc) ?#6.2(C) R?#39.2 R?#43.2 R?#56.2  [project net D7]
+12V: ?#7.2 ?#8.1 ?#9.1 ?#10.2 D?#15.K D?#16.K D?#20.K D?#21.K R?#54.1 R?#55.1 R?#58.1 R?#59.1
-5V: ?#5.3(C)
GND: *#5.4(VSS) *?#12.7(GND) *?#13.8(GND) *?#13.11(MR) C?#42.1 C?#43.1 D?#13.K Q?#3.1(E) Q?#4.2(E) Q?#5.2(E) Q?#6.2(E) Q?#7.2(E) R?#53.1 R?#53.2 R?#53.3 R?#53.4 R?#53.5 R?#53.6 R?#53.7 R?#53.8
DIG0: *#5.18(DIG0) DS?#1.1(K) R?#38.2
DIG1: *#5.19(DIG1) DS?#2.1(K) R?#40.2
DIG2: *#5.20(DIG2) DS?#3.1(K) R?#41.2
DIG3: *#5.21(DIG3) DS?#4.1(K) R?#42.2
DIG4: *#5.22(DIG4) DS?#5.1(K)
DIG5: *#5.23(DIG5) DS?#6.1(K)
DIG6: *#5.24(DIG6) DS?#7.1(K)
DIG7: *#5.25(DIG7) DS?#8.1(K)
DP: DS?#1.7(DP) DS?#2.7(DP) DS?#3.7(DP) DS?#4.7(DP) DS?#5.7(DP) DS?#6.7(DP) DS?#7.7(DP) DS?#8.7(DP) R?#45.2
SA: DS?#1.10(a) DS?#2.10(a) DS?#3.10(a) DS?#4.10(a) DS?#5.10(a) DS?#6.10(a) DS?#7.10(a) DS?#8.10(a) R?#46.2
SB: DS?#1.9(b) DS?#2.9(b) DS?#3.9(b) DS?#4.9(b) DS?#5.9(b) DS?#6.9(b) DS?#7.9(b) DS?#8.9(b) R?#47.2
SC: DS?#1.8(c) DS?#2.8(c) DS?#3.8(c) DS?#4.8(c) DS?#5.8(c) DS?#6.8(c) DS?#7.8(c) DS?#8.8(c) R?#48.2
SD: DS?#1.5(d) DS?#2.5(d) DS?#3.5(d) DS?#4.5(d) DS?#5.5(d) DS?#6.5(d) DS?#7.5(d) DS?#8.5(d) R?#49.2 S?#2.1 S?#6.1 S?#10.1 S?#14.1
SE: DS?#1.4(e) DS?#2.4(e) DS?#3.4(e) DS?#4.4(e) DS?#5.4(e) DS?#7.4(e) DS?#8.4(e) R?#50.2 S?#3.1 S?#7.1 S?#11.1 S?#15.1
S~{E}: DS?#6.4(e)
SF: DS?#1.2(f) DS?#2.2(f) DS?#3.2(f) DS?#4.2(f) DS?#5.2(f) DS?#6.2(f) DS?#7.2(f) DS?#8.2(f) R?#51.2 S?#4.1 S?#8.1 S?#12.1 S?#16.1
SG: DS?#1.3(g) DS?#2.3(g) DS?#3.3(g) DS?#4.3(g) DS?#5.3(g) DS?#6.3(g) DS?#7.3(g) DS?#8.3(g) R?#52.2 S?#5.1 S?#9.1 S?#13.1 S?#17.1
Net*#5_6: *#5.6(~{CS}) ; port 7279~{CS}
Net*#5_7: *#5.7(CLK) ; port 7279CLK
Net*#5_8: *#5.8(DATA) ; port 7279DATA
Net*#5_9: *#5.9(~{KEY}) ; port 7279~{KEY}
Net*#5_10: *#5.10(SG) R?#52.1 R?#53.16
Net*#5_11: *#5.11(SF) R?#51.1 R?#53.15
Net*#5_12: *#5.12(SE) R?#50.1 R?#53.14
Net*#5_13: *#5.13(SD) R?#49.1 R?#53.13
Net*#5_14: *#5.14(SC) R?#48.1 R?#53.12
Net*#5_15: *#5.15(SB) R?#47.1 R?#53.11
Net*#5_16: *#5.16(SA) R?#46.1 R?#53.10
Net*#5_17: *#5.17(DP) R?#45.1 R?#53.9
Net*#5_27: *#5.27(RC) C?#43.2 R?#56.1
Net*?#12_10: *?#12.10(5Y) ; port PULSE
Net*?#12_11: *?#12.11(5A) *?#12.12(6Y)
Net*?#12_13: *?#12.13(6A) C?#42.2 Q?#3.3(C) R?#39.1
Net*?#13_3: *?#13.3(Q4) ; port 125KHz
Net*?#13_4: *?#13.4(Q6) ; port 31.25KHz
Net*?#13_6: *?#13.6(Q2) ; port 500KHz
Net*?#13_9: *?#13.9(Q0) ; port 2MHz
Net*?#13_10: *?#13.10(~{CP}) ; port HC4040CLK
Net?#5_1: ?#5.1(B) R?#36.2
Net?#6_1: ?#6.1(B) R?#37.2
Net?#7_1: ?#7.1 D?#14.2 D?#15.A Q?#4.3(C)
Net?#8_2: ?#8.2 D?#16.A D?#17.2 Q?#5.3(C)
Net?#9_2: ?#9.2 D?#18.2 D?#20.A Q?#7.3(C)
Net?#10_1: ?#10.1 D?#19.2 D?#21.A Q?#6.3(C)
NetD?#13_A: D?#13.A R?#43.1
NetD?#14_1: D?#14.1 R?#54.2
NetD?#17_1: D?#17.1 R?#55.2
NetD?#18_1: D?#18.1 R?#59.2
NetD?#19_1: D?#19.1 R?#58.2
NetQ?#4_1: Q?#4.1(B) R?#44.2
NetQ?#5_1: Q?#5.1(B) R?#57.2
NetQ?#6_1: Q?#6.1(B) R?#61.2
NetQ?#7_1: Q?#7.1(B) R?#60.2
NetR?#36_1: R?#36.1 R?#37.1 ; port DJ
NetR?#38_1: R?#38.1 S?#2.2 S?#3.2 S?#4.2 S?#5.2
NetR?#40_1: R?#40.1 S?#6.2 S?#7.2 S?#8.2 S?#9.2
NetR?#41_1: R?#41.1 S?#10.2 S?#11.2 S?#12.2 S?#13.2
NetR?#42_1: R?#42.1 S?#14.2 S?#15.2 S?#16.2 S?#17.2
NetR?#44_1: R?#44.1 ; port D
NetR?#57_1: R?#57.1 ; port C
NetR?#60_1: R?#60.1 ; port A
NetR?#61_1: R?#61.1 ; port B

Not connected (* = marked no-connect by the designer): *#5 3(NC) 5(NC) 26(CLKO); *?#12 1(1A) 2(1Y) 3(2A) 4(2Y) 5(3A) 6(3Y) 8(4Y) 9(4A); *?#13 1(Q11) 2(Q5) 5(Q3) 7(Q1) 12(Q8) 13(Q7) 14(Q9) 15(Q10); ?#5 2(E); ?#6 3(E); B? 1 2; DS?#1 6(K); DS?#2 6(K); DS?#3 6(K); DS?#4 6(K); DS?#5 6(K); DS?#6 6(K); DS?#7 6(K); DS?#8 6(K)

### Notes on the sheet
- 键盘与LED
- 直流电机及测速
- (near *?#13) 分频器
- (near Q?#3) |
  |
  |
  |
- (near Q?#3) 光电码盘
- 步进电机
- LED与键盘,电机，分频器
- 孟雨皞
- Labels drawn without touching a wire or pin: GND
- (in symbol bujindianji) 步进电机
- (in symbol Motor) M

### Library data of the parts
?#5 = PNP: PNP Transistor
?#6 = NPN: NPN Transistor
?#7-?#10 = Inductor: Code_IEC: 1005; Value: 10mH; Published: 8-Jun-2000; LatestRevisionDate: 29-May-2009; LatestRevisionNote: IPC-7351 Footprint Added.; PackageReference: 0402-A; Publisher: Altium Limited; PackageDescription: Chip Inductor; Code_JEITA: 0402
B? = Motor: Motor, General Kind; Published: 24-Mar-1999; LatestRevisionDate: 17-Jul-2002; LatestRevisionNote: Re-released for DXP Platform.; PackageReference: RB5-10.5; Publisher: Altium Limited; PackageDescription: Capacitor (Radial); 2 Leads
C?#42 C?#43 = Cap: Capacitor; Published: 8-Jun-2000; LatestRevisionDate: 17-Jul-2002; LatestRevisionNote: Re-released for DXP Platform.; PackageReference: RAD-0.3; Publisher: Altium Limited
D?#15 D?#16 D?#20 D?#21 = 二极管
DS?#1-DS?#8 = Dpy Red-CC: 7.62 mm Black Surface HER 7-Segment Display: CC, RH DP; MinimumIntensity: 360 ucd; Note: IF = 5 mA; Colour: High Efficiency Red (HER); Note: Pins 1 and 6 are redundant Cathodes.; Published: 8-Jun-2000; LatestRevisionDate: 17-Dec-2003; LatestRevisionNote: Schematic revised, PCB Footprint replaced.; DatasheetVersion: 19-Feb-2002; PackageVersion: 11-Feb-2002; PackageReference: A; Publisher: Altium Limited; PackageDescription: LED, 7-Segment Display, 7.62 mm, RHD; 10 Leads; Row Space 5.08 mm; Pitch 2.54 mm; ComponentLink1Description: Manufacturer Link; ComponentLink1URL: http://www.agilent.com/
Q?#3-Q?#7 = 2N3904: NPN General Purpose Amplifier; Published: 8-Jun-2000; LatestRevisionDate: 15-Jan-2003; LatestRevisionNote: PCB Footprint 'BCY-W3/D4.7' replaced; PackageReference: TO-92A; Publisher: Altium Limited; Code_JEDEC: TO-92A; ComponentLink1Description: Manufacturer Link; ComponentLink1URL: http://www.fairchildsemi.com/; ComponentLink2Description: Datasheet; ComponentLink2URL: http://www.fairchildsemi.com/ds/2N%2F2N3904.pdf
  Q?#3: DatasheetVersion: 1997; PackageVersion: Sep-1998
  Q?#4-Q?#7: DatasheetDocument: 1997; PackageDocument: Sep-1998
R?#36-R?#43 R?#45-R?#52 R?#56 = 电阻
R?#44 R?#54 R?#55 R?#57-R?#61 = Res2: Resistor; Published: 8-Jun-2000; LatestRevisionDate: 17-Jul-2002; LatestRevisionNote: Re-released for DXP Platform.; PackageReference: AXIAL-0.4; Publisher: Altium Limited
R?#53 = Res Pack3: Isolated Resistor Network; Published: 24-Mar-1999; LatestRevisionDate: 29-May-2009; LatestRevisionNote: IPC-7351 Footprint Added.; PackageReference: SO-16; Publisher: Altium Limited; PackageDescription: 16-Pin Small Outline Integrated Circuit 1.27 mm Pitch; Code_JEDEC: MS-012-AC; Code_IPC: SOIC127P600-16

## Nets that join several sheets
+12V: ADC_DAC (L?#2.1 U?#3.7 u?#4.14), KeyLED (12 pins)
D7: ADC_DAC (19 pins), CPU (27 pins), KeyLED (9 pins)
GND: ADC_DAC (30 pins), CPU (30 pins), KeyLED (20 pins)
Net*?#12_10: CPU (U?#10.14), KeyLED (*?#12.10)